# Altium schematic sheet POWER SWITCH AND LDO.SchDoc
size 420 x 297 mm; SheetNumber: 3; SheetTotal: 6
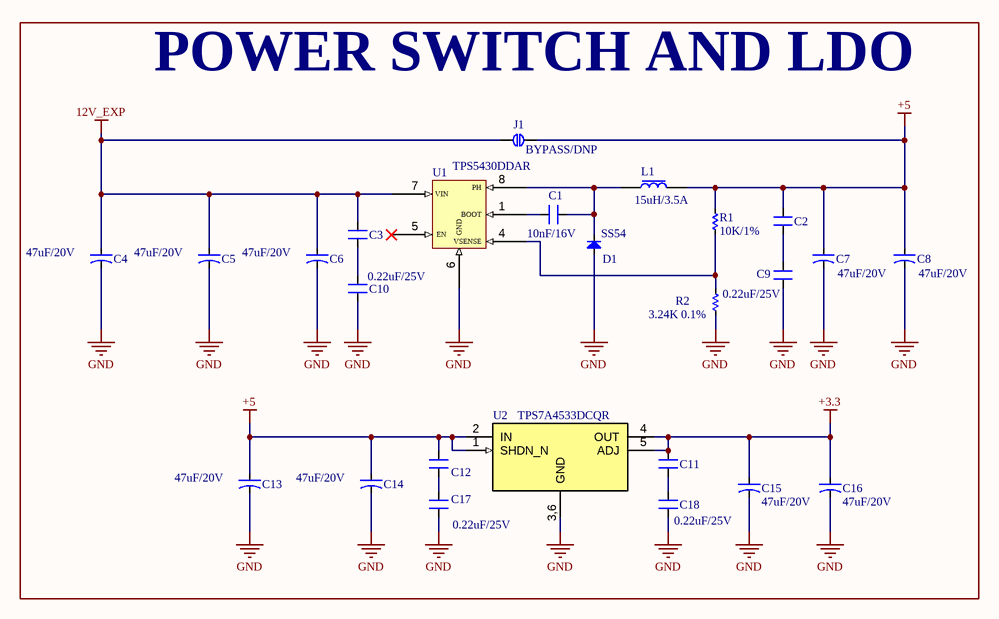
[diagram p0: POWER SWITCH AND LDO.SchDoc]

## Parts
C1  10nF/16V  [SM-0603]
C2  0.22uF/25V  [SM-0603]  (value not drawn)
C3  0.22uF/25V  [SM-0603]  (value not drawn)
C4  47uF/20V  [CAP TANT 2312]
C5  47uF/20V  [CAP TANT 2312]
C6  47uF/20V  [CAP TANT 2312]
C7  47uF/20V  [CAP TANT 2312]
C8  47uF/20V  [CAP TANT 2312]
C9  0.22uF/25V  [SM-0603]
C10  0.22uF/25V  [SM-0603]
C11  0.22uF/25V  [SM-0603]  (value not drawn)
C12  0.22uF/25V  [SM-0603]
C13  47uF/20V  [CAP TANT 2312]
C14  47uF/20V  [CAP TANT 2312]
C15  47uF/20V  [CAP TANT 2312]
C16  47uF/20V  [CAP TANT 2312]
C17  0.22uF/25V  [SM-0603]  (value not drawn)
C18  0.22uF/25V  [SM-0603]
D1  SS54  [DIO-SMD-A]
J1  BYPASS/DNP  [BIG_CONNECTOR]
L1  15uH/3.5A  [SRP7050TA]
R1  10K/1%  [RES-SMD-0603]
R2  3.24K 0.1%  [RES-SMD-0603]
U1  TPS5430DDAR  [HSOP8]
U2  TPS7A4533DCQR  [SOT223-6]

## Blocks framed on the sheet
POWER SWITCH AND LDO: C1-C18 D1 J1 L1 R1 R2 U1 U2

## Nets
12V_EXP: C3.2 C4.1 C5.1 C6.1 J1.1 U1.7(VIN)
+3.3: C11.2 C15.1 C16.1 U2.4(OUT) U2.5(ADJ)
+5: C2.2 C7.1 C8.1 C12.2 C13.1 C14.1 J1.2 L1.2 R1.2 U2.1(SHDN_N) U2.2(IN)
GND: C4.2 C5.2 C6.2 C7.2 C8.2 C9.1 C10.1 C13.2 C14.2 C15.2 C16.2 C17.1 C18.1 D1.1(A) R2.1 U1.6(GND) U2.3,6(GND)
NetC1_1: C1.1 D1.2(K) L1.1 U1.8(PH)
NetC1_2: C1.2 U1.1(BOOT)
NetC2_1: C2.1 C9.2
NetC3_1: C3.1 C10.2
NetC11_1: C11.1 C18.2
NetC12_1: C12.1 C17.2
NetR1_1: R1.1 R2.2 U1.4(VSENSE)

Not connected (* = marked no-connect by the designer): U1 5(EN)*

## Notes on the sheet
- Project:
- BEE-PC1
- Sub-system:
- Design by:
- Hung Nguyen D.
- Bao Bui Q.
- Sheet title:
- Sheet
- A3
- of
- Checked by:
- Approved by:
- Vu Pham
- Revision:
- Document No:
- V1.3.0
- Size:
- Date:

## Library data of the parts
C1 = CM: CL10B103KB8NNNC; Value: 103
C2 C3 C9-C12 C17 C18 = CM: CL10B224KA8NNNC; Value: 103
C4-C8 C13-C16 = CN-ALU-SMD: TAJC476K020RNJ; Published: 8-Jun-2000; LatestRevisionDate: 17-Jul-2002; LatestRevisionNote: Re-released for DXP Platform.; PackageReference: POLAR0.8; Publisher: Altium Limited
D1 = Diode SMD: Code - JEDEC: DO-214-AB; Value: 1N5007; Published: 8-Jun-2000; Revision: July-2002: Re-released for DXP Platform.; Publisher: Altium Limited
J1 = CNT: DNP
L1 = INDUCTOR: SRP7050TA-150M
R1 = Res-SMD: ERJ-3EKF1002V; Manufacturer: Generic Components; Class: Passive; Published: 08/06/2000; Publisher: Altium Hobart Technology Centre
R2 = Res-SMD: ERJ-3EKF3241V; Manufacturer: Generic Components; Class: Passive; Published: 08/06/2000; Publisher: Altium Hobart Technology Centre
U1 = TPS543X: pin to pad: 6>6+9